# EAGLE design open-lux-U (EAGLE 6.5.0)
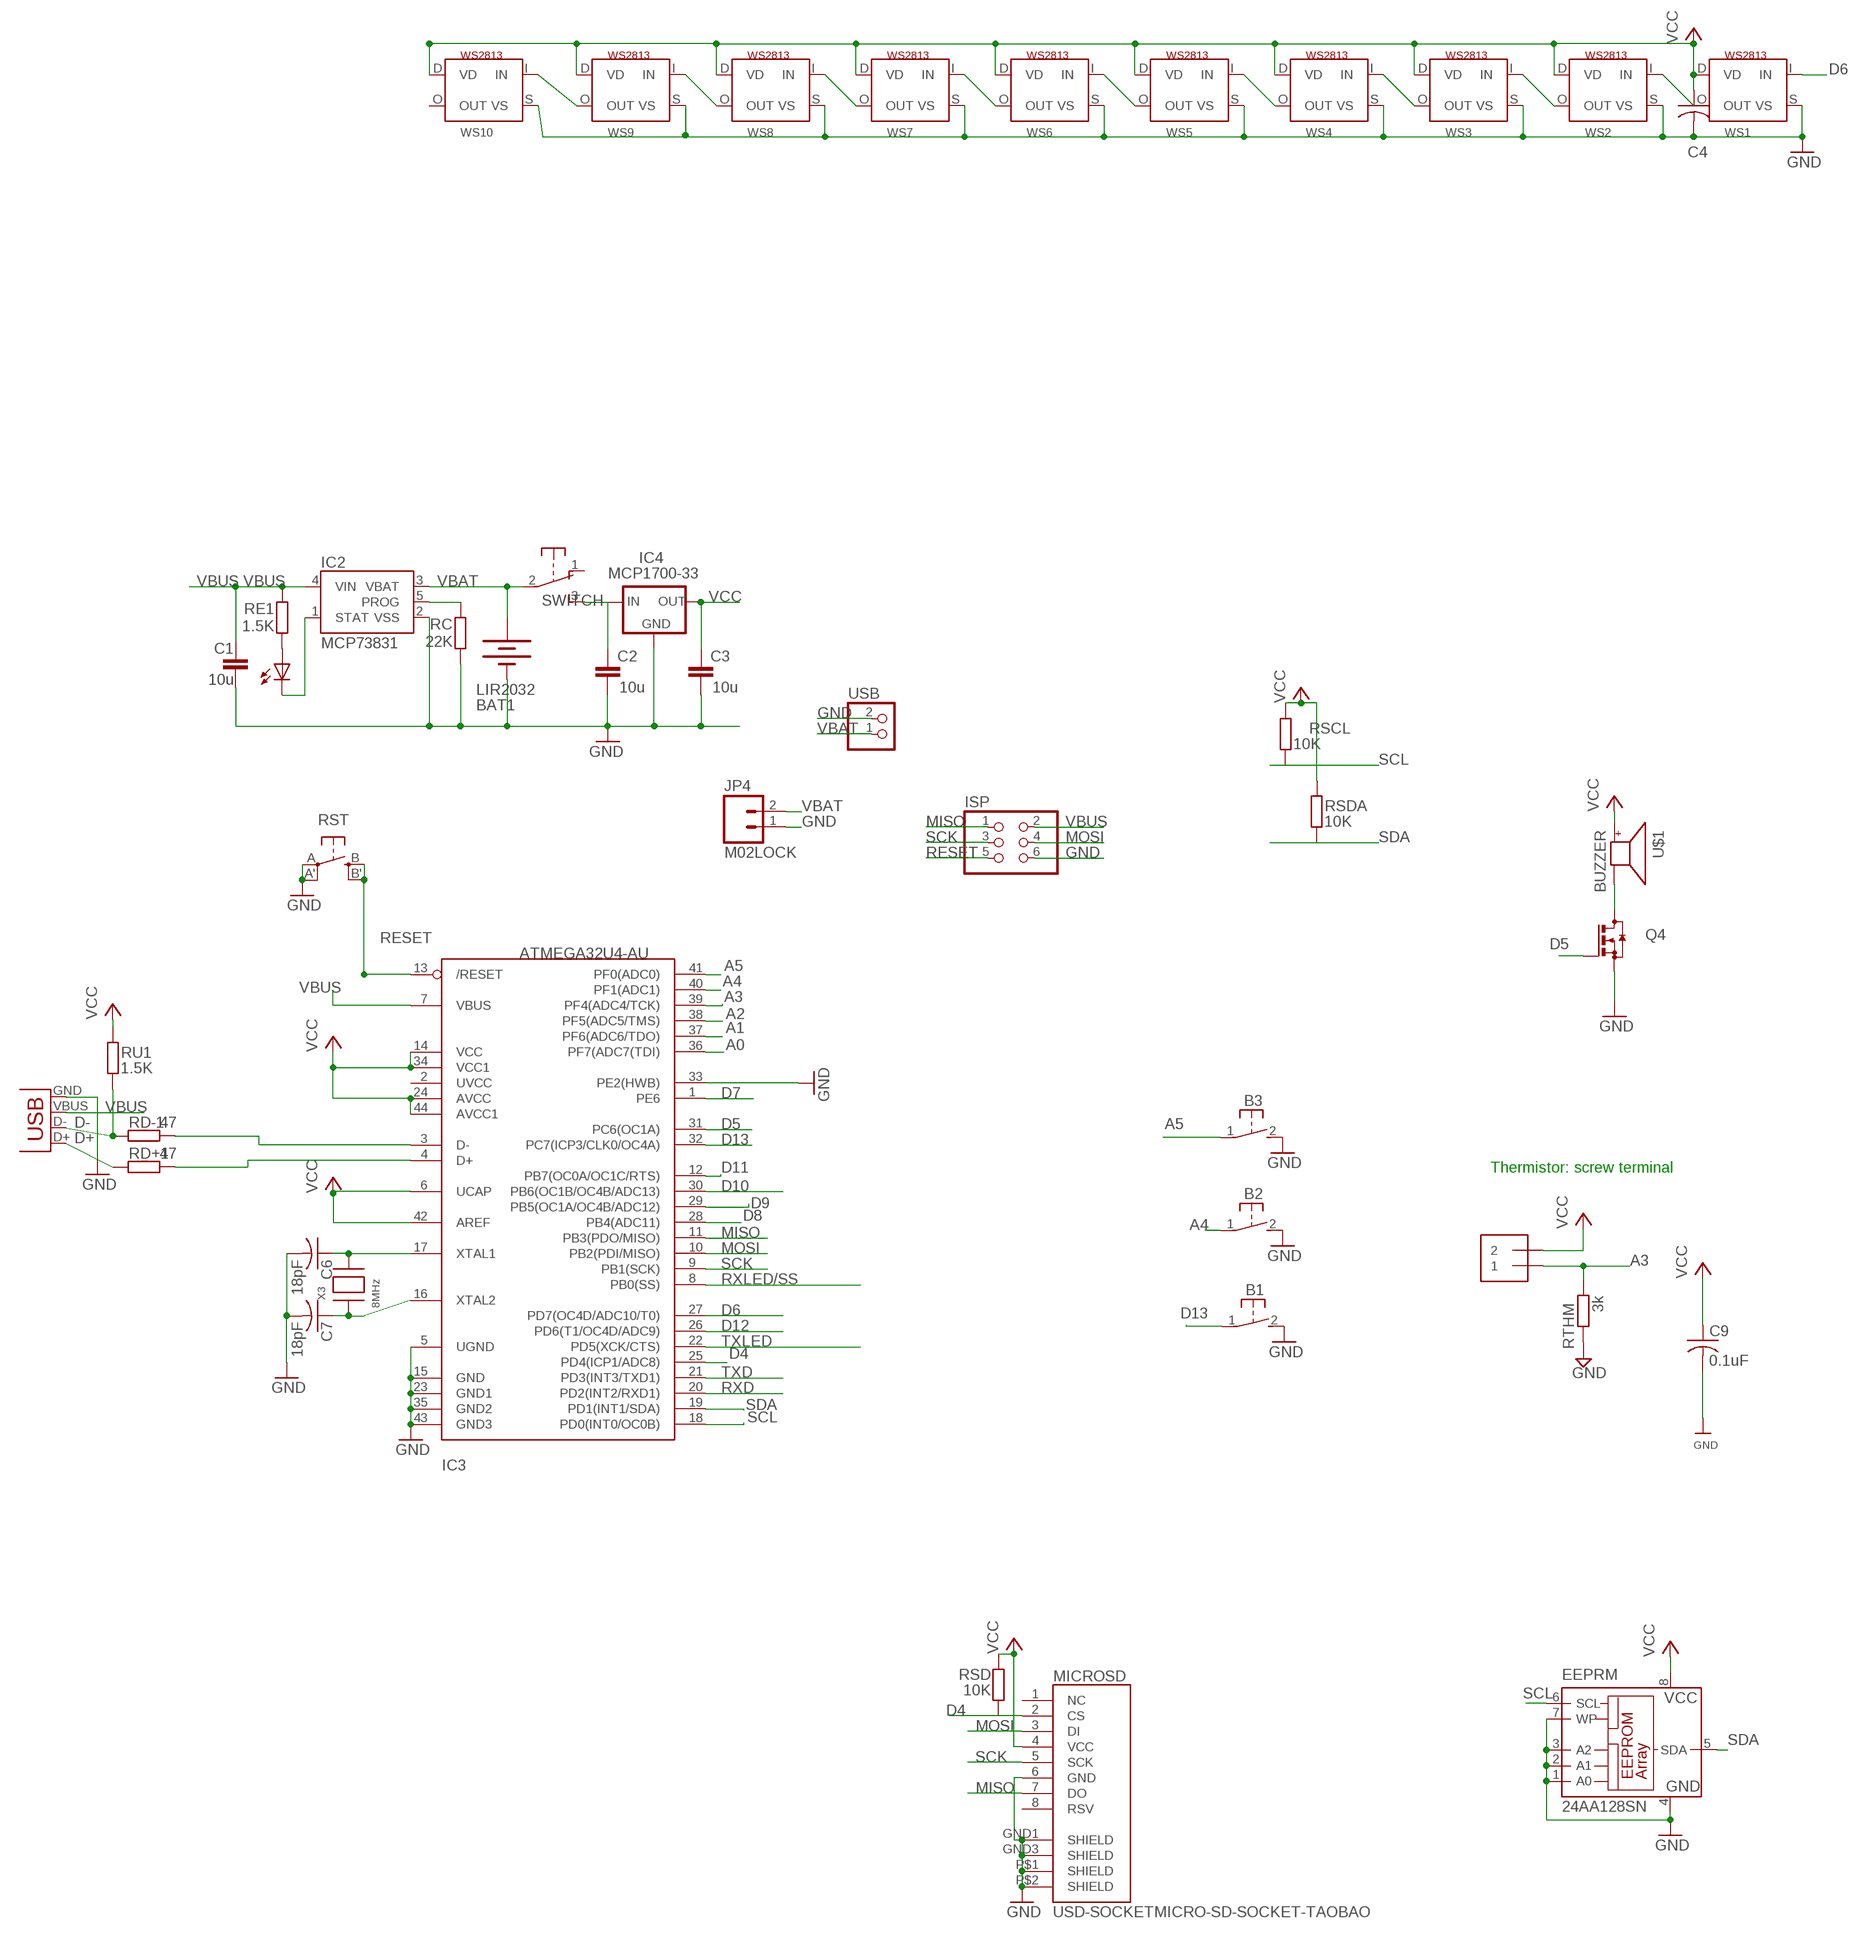
[diagram p0: schematic, sheet 1, part 1 of 2]
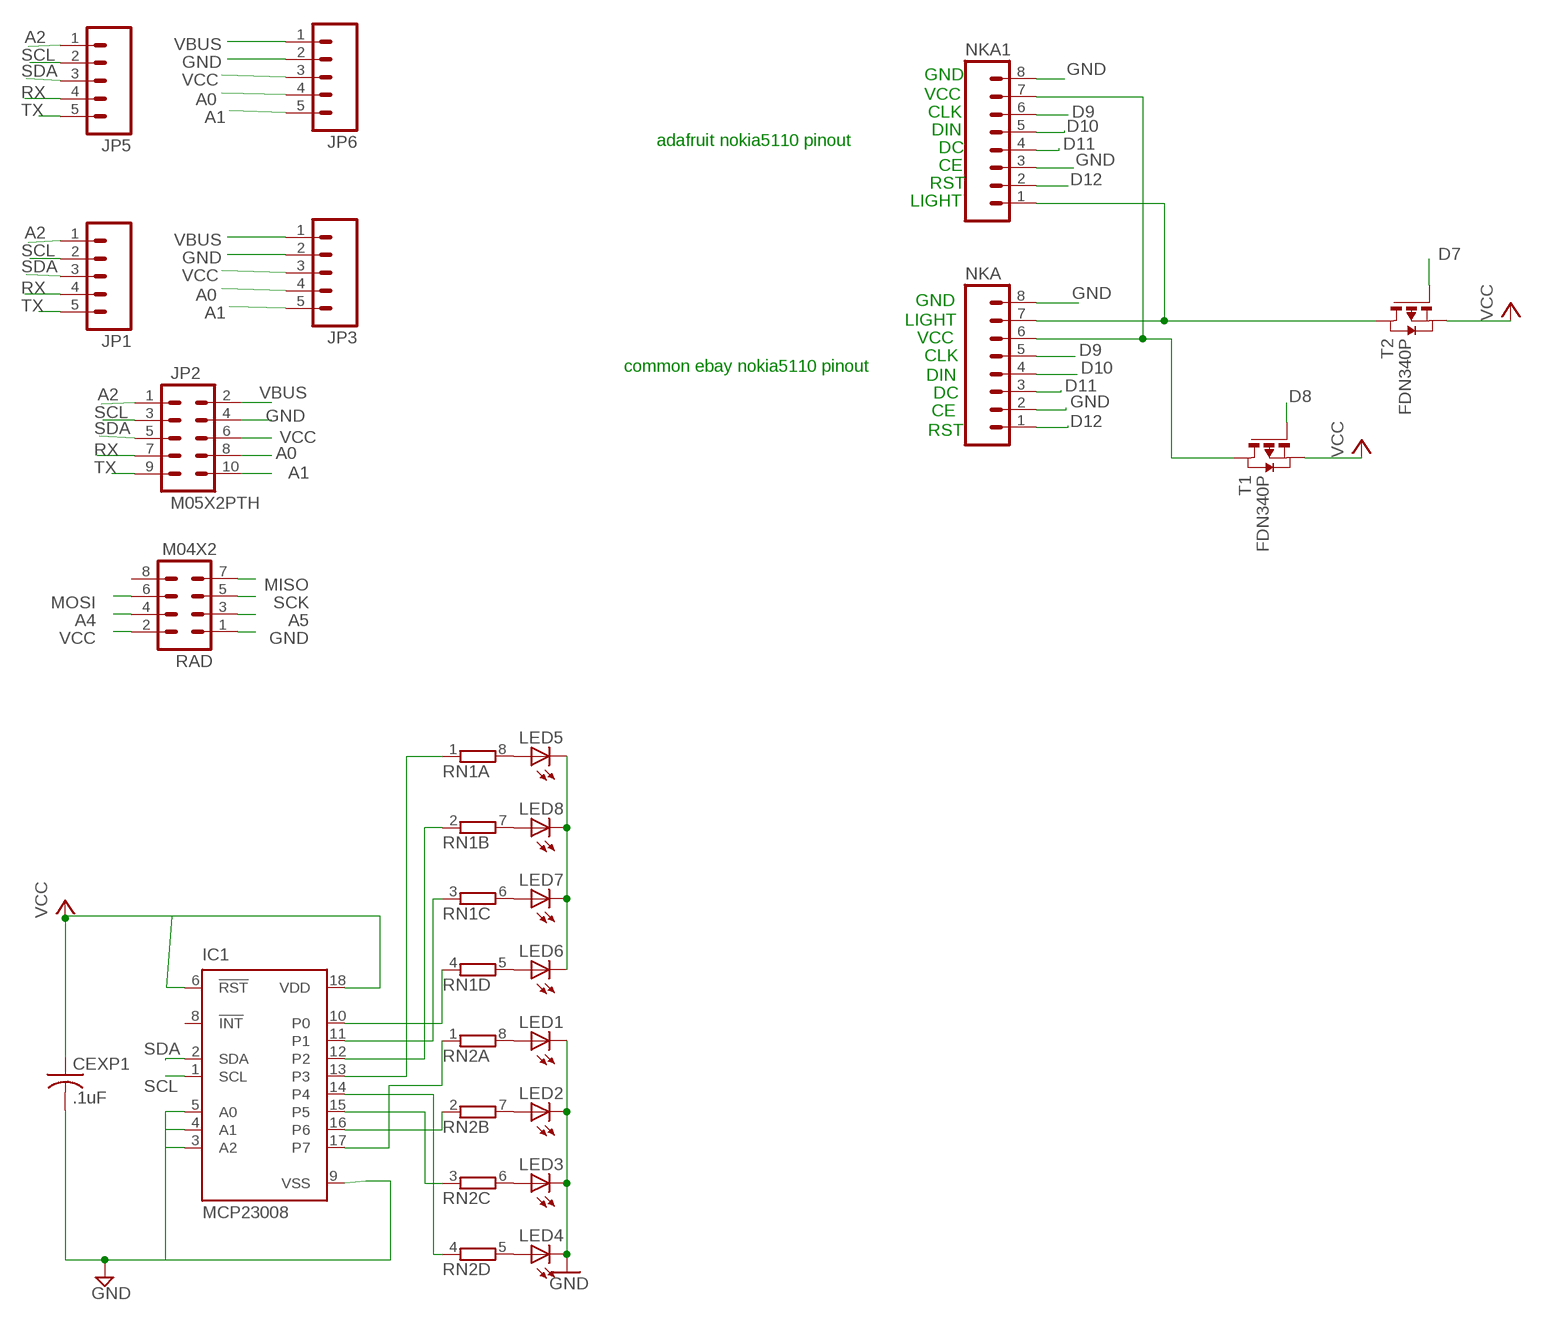
[diagram p1: schematic, sheet 1, part 2 of 2]

## Parts
B1  31-XX  [B3F-31XX]
B2  31-XX  [B3F-31XX]
B3  31-XX  [B3F-31XX]
BAT1  LIR2032  BATTERYBATTCOM_20MM_PTH_SMT  [BATTCOM_20MM_PTH_SMT]
C1  10u  C-EUC0805  [C0805]
C2  10u  C-EUC0805  [C0805]
C3  10u  C-EUC0805  [C0805]
C4  C-USC0805K  [C0805K]
C6  18pF  C-USC0805K  [C0805K]
C7  18pF  C-USC0805K  [C0805K]
C9  0.1uF  C-USC0805  [C0805]
CEXP1  .1uF  C-USC0805K  [C0805K]
EEPRM  24AA128SN  [SO-08]
IC1  MCP23008  MCP23008T  [SO18W]
IC2  MCP73831  [SOT23-5]
IC3  ATMEGA32U4-AU  [TQFP44]
IC4  MCP1700-33  MCP1700SOT233  [SOT23]
ISP  PINHD-2X3  [2X03]
JP1  M05LOCK  [1X05_LOCK]
JP2  M05X2PTH  [AVR_ICSP]
JP3  M05LOCK  [1X05_LOCK]
JP4  M02LOCK  [1X02_LOCK]
JP5  M05LOCK  [1X05_LOCK]
JP6  M05LOCK  [1X05_LOCK]
LED1  LED3MM  [LED3MM]
LED2  LED3MM  [LED3MM]
LED3  LED3MM  [LED3MM]
LED4  LED3MM  [LED3MM]
LED5  LED3MM  [LED3MM]
LED6  LED3MM  [LED3MM]
LED7  LED3MM  [LED3MM]
LED8  LED3MM  [LED3MM]
MICROSD  USD-SOCKETMICRO-SD-SOCKET-TAOBAO  [MICRO-SD-SOCKET-TAOBAO]
NKA  M08LOCK  [1X08_LOCK]
NKA1  M08LOCK  [1X08_LOCK]
PWR  0805  LEDCHIPLED_0805  [CHIPLED_0805]
Q4  BSS123  [SOT23]
RAD  M04X2  [2X4]
RC  22K  R-EU_R0805  [R0805]
RD+1  47  R-EU_R0805  [R0805]
RD-1  47  R-EU_R0805  [R0805]
RE1  1.5K  R-EU_R0805  [R0805]
RN1  4R-NEXB38V  [EXB38V]
RN2  4R-NEXB38V  [EXB38V]
RSCL  10K  R-EU_R0805  [R0805]
RSD  10K  R-EU_R0805  [R0805]
RSDA  10K  R-EU_R0805  [R0805]
RST  EVQQ2  [EVQ-Q2]
RTHM  3k  R-EU_0204/7  [0204/7]
RU1  1.5K  R-EU_R0805  [R0805]
SWITCH  EG1206  [EG1206]
T1  FDN340P  PMOSSOT23  [SOT-23]
T2  FDN340P  PMOSSOT23  [SOT-23]
THM1  1X2-3.5MM  [1X2-3.5MM]
U$1  BUZZER  [SMT-8585-BUZZER]
USB  JST_2PIN-SMT-RA  [JST-PH-2-SMT-RA]
WS1  WS2813  [RGBLED5050_4]
WS2  WS2813  [RGBLED5050_4]
WS3  WS2813  [RGBLED5050_4]
WS4  WS2813  [RGBLED5050_4]
WS5  WS2813  [RGBLED5050_4]
WS6  WS2813  [RGBLED5050_4]
WS7  WS2813  [RGBLED5050_4]
WS8  WS2813  [RGBLED5050_4]
WS9  WS2813  [RGBLED5050_4]
WS10  WS2813  [RGBLED5050_4]
X2  USBSMD  [USB-MINIB]
X3  8MHz  XTALNX5032  [NX5032]

## Nets
A0: IC3.36(PF7(ADC7(TDI)) JP2.8 JP3.4 JP6.4
A1: IC3.37(PF6(ADC6/TDO)) JP2.10 JP3.5 JP6.5
A2: IC3.38(PF5(ADC5/TMS)) JP1.1 JP2.1 JP5.1
A3: IC3.39(PF4(ADC4/TCK)) RTHM.2 THM1.1
A4: B2.1(P) IC3.40(PF1(ADC1)) RAD.4
A5: B3.1(P) IC3.41(PF0(ADC0)) RAD.3
D4: IC3.25(PD4(ICP1/ADC8)) MICROSD.2(CS) RSD.1
D5: IC3.31(PC6(OC1A)) Q4.1(G)
D6: IC3.27(PD7(OC4D/ADC10/T0)) WS1.I(IN)
D7: IC3.1(PE6) T2.3(G)
D8: IC3.28(PB4(ADC11)) T1.3(G)
D9: IC3.29(PB5(OC1A/OC4B/ADC12)) NKA1.6 NKA.5
D10: IC3.30(PB6(OC1B/OC4B/ADC13)) NKA1.5 NKA.4
D11: IC3.12(PB7(OC0A/OC1C/RTS)) NKA1.4 NKA.3
D12: IC3.26(PD6(T1/OC4D/ADC9)) NKA1.2 NKA.1
D13: B1.1(P) IC3.32(PC7(ICP3/CLK0/OC4A))
D+: RD+1.1 X2.D+
D-: RD-1.1 RU1.1 X2.D-
GND: B1.2(S) B2.2(S) B3.2(S) BAT1.P$1(-) C1.2 C2.2 C3.2 C4.2 C6.2 C7.2 C9.2 CEXP1.2 EEPRM.1(A0) EEPRM.2(A1) EEPRM.3(A2) EEPRM.4(GND) EEPRM.7(WP) IC1.3(A2) IC1.4(A1) IC1.5(A0) IC1.9(VSS) IC2.2(VSS) IC3.5(UGND) IC3.15(GND) IC3.23(GND1) IC3.33(PE2(HWB)) IC3.35(GND2) IC3.43(GND3) IC4.1(GND) ISP.6 JP2.4 JP3.2 JP4.1 JP6.2 LED1.K(C) LED2.K(C) LED3.K(C) LED4.K(C) MICROSD.6(GND) MICROSD.GND1(SHIELD) MICROSD.GND3(SHIELD) MICROSD.P$1(SHIELD) MICROSD.P$2(SHIELD) NKA1.3 NKA1.8 NKA.2 NKA.8 Q4.2(S) RAD.1 RC.1 RST.A'(P1) RST.A(P) RTHM.1 USB.2 WS1.S(VS) WS2.S(VS) WS3.S(VS) WS4.S(VS) WS5.S(VS) WS6.S(VS) WS7.S(VS) WS8.S(VS) WS9.S(VS) WS10.S(VS) X2.GND
MISO: IC3.11(PB3(PDO/MISO)) ISP.1 MICROSD.7(DO) RAD.7
MOSI: IC3.10(PB2(PDI/MISO)) ISP.4 MICROSD.3(DI) RAD.6
N$1: C2.1 IC4.3(IN) SWITCH.3(S)
N$2: C7.1 IC3.16(XTAL2) X3.P$1
N$3: C6.1 IC3.17(XTAL1) X3.P$2
N$4: WS9.O(OUT) WS10.I(IN)
N$5: IC2.1(STAT) PWR.C
N$6: IC2.5(PROG) RC.2
N$7: Q4.3(D) U$1.-
N$8: IC1.14(P4) RN2.4
N$9: T2.1(D)
N$10: PWR.A RE1.1
N$11: IC1.15(P5) RN2.3
N$12: NKA1.1 NKA.7
N$13: IC1.16(P6) RN2.2
N$14: WS6.O(OUT) WS7.I(IN)
N$15: IC1.17(P7) RN2.1
N$17: LED1.A RN2.8
N$18: LED2.A RN2.7
N$19: WS4.O(OUT) WS5.I(IN)
N$20: WS5.O(OUT) WS6.I(IN)
N$21: IC3.4(D+) RD+1.2
N$22: IC3.3(D-) RD-1.2
N$23: WS1.O(OUT) WS2.I(IN)
N$24: WS2.O(OUT) WS3.I(IN)
N$25: WS3.O(OUT) WS4.I(IN)
N$26: LED3.A RN2.6
N$27: WS8.O(OUT) WS9.I(IN)
N$28: WS7.O(OUT) WS8.I(IN)
N$29: LED4.A RN2.5
N$30: LED5.K(C) LED6.K(C) LED7.K(C) LED8.K(C)
N$31: NKA1.7 NKA.6 T1.1(D)
N$32: LED5.A RN1.8
N$33: LED6.A RN1.5
N$34: LED7.A RN1.6
N$35: LED8.A RN1.7
N$37: IC1.13(P3) RN1.1
N$38: IC1.12(P2) RN1.2
N$39: IC1.11(P1) RN1.3
N$40: IC1.10(P0) RN1.4
RESET: IC3.13(/RESET) ISP.5 RST.B'(S1) RST.B(S)
RX: JP1.4 JP2.7 JP5.4
RXD: IC3.20(PD2(INT2/RXD1))
RXLED/SS: IC3.8(PB0(SS))
SCK: IC3.9(PB1(SCK)) ISP.3 MICROSD.5(SCK) RAD.5
SCL: EEPRM.6(SCL) IC1.1(SCL) IC3.18(PD0(INT0/OC0B)) JP1.2 JP2.3 JP5.2 RSCL.1
SDA: EEPRM.5(SDA) IC1.2(SDA) IC3.19(PD1(INT1/SDA)) JP1.3 JP2.5 JP5.3 RSDA.1
TX: JP1.5 JP2.9 JP5.5
TXD: IC3.21(PD3(INT3/TXD1))
TXLED: IC3.22(PD5(XCK/CTS))
VBAT: BAT1.P$2(+) IC2.3(VBAT) JP4.2 SWITCH.2(P) USB.1
VBUS: C1.1 IC2.4(VIN) IC3.7(VBUS) ISP.2 JP2.2 JP3.1 JP6.1 RE1.2 X2.VBUS
VCC: C3.1 C4.1 C9.1 CEXP1.1 EEPRM.8(VCC) IC1.6(!RST) IC1.18(VDD) IC3.6(UCAP) IC3.14(VCC) IC3.24(AVCC) IC3.34(VCC1) IC3.42(AREF) IC3.44(AVCC1) IC4.2(OUT) JP2.6 JP3.3 JP6.3 MICROSD.4(VCC) RAD.2 RSCL.2 RSD.2 RSDA.2 RU1.2 T1.2(S) T2.2(S) THM1.2 U$1.+ WS1.D(VD) WS2.D(VD) WS3.D(VD) WS4.D(VD) WS5.D(VD) WS6.D(VD) WS7.D(VD) WS8.D(VD) WS9.D(VD) WS10.D(VD)
Unconnected: IC1.8(!INT) IC3.2(UVCC) MICROSD.1(NC) MICROSD.8(RSV) RAD.8 SWITCH.1(O) WS10.O(OUT)

## Notes on the sheet
- GND
- VCC
- CLK
- adafruit nokia5110 pinout | DIN
- DC
- CE
- RST
- LIGHT
- GND
- LIGHT
- VCC
- common ebay nokia5110 pinout | CLK
- DIN
- DC
- CE
- RST
- Thermistor: screw terminal

## Library data of the parts
B1-B3 = adafruit:31-XX: OMRON SWITCH Now with beefier pads!
BAT1 = SparkFunNew:BATTERY: Battery Holders Various common sizes : AA, AAA, 20mm coin cell and 12mm coin cell.
C1-C3 = resistor:C-EU: CAPACITOR, European symbol
C4 = adafruit2013:C-US: CAPACITOR, American symbol
C6 C7 C9 CEXP1 = adafruit:C-US: CAPACITOR, American symbol
EEPRM = microchip:24*: Serial EEPROM I2C; MF: MICROCHIP; MPN: 24AA128-I/SN; OC_FARNELL: unknown; OC_NEWARK: 92C6842
IC1 = JeeLabs:MCP23008: I2C-Bus Remote 8-bit I/O expander http://www.semiconductors.philips.com/acrobat_download/datasheets/PCF8574_4.pdf
IC2 = SparkFunNew:MCP73831: Microchip's MCP73831 Miniature single cell, fully integrated Li-Ion, Li-polymer charge management controller http://ww1.microchip.com/downloads/en/DeviceDoc/21984a.pdf
IC3 = adaprog:ATMEGA32U4
IC4 = adafruit:MCP1700: VOLTAGE REGULATOR
ISP = pinhead:PINHD-2X3: PIN HEADER
JP1 JP3 JP5 JP6 = SparkFun-Connectors:M05: Header 5 Standard 5-pin 0.1" header. Use with straight break away headers (SKU : PRT-00116), right angle break away headers (PRT-00553), swiss pins (PRT-00743), machine pins (PRT-00117), and female headers (PRT-00115). Molex polarized connector foot print use with SKU : PRT-08230 with associated crimp pins and housings.
JP2 = SparkFun-Connectors:M05X2: Header 5x2 Standard 10-pin dual row 0.1" header. Commonly used with AVR-ISP. Use with Spark Fun Electronics SKU: PRT-00778
JP4 = SparkFun-Connectors:M02: Standard 2-pin 0.1" header. Use with - straight break away headers ( PRT-00116) - right angle break away headers (PRT-00553) - swiss pins (PRT-00743) - machine pins (PRT-00117) - female headers (PRT-00115) Molex polarized connector foot print use with: PRT-08233 with associated crimp pins and housings. 2.54_SCREWTERM for use with PRT-10571. 3.5mm Screw Terminal footprints for PRT-08084 5mm Screw Terminal footprints for use with PRT-08433
LED1-LED8 = adafruit:LED: LED
MICROSD = SparkFunNew:USD-SOCKET: microSD Socket Push-push type uSD socket. Schematic element and footprint production proven. Spark Fun Electronics SKU : PRT-00127. tDoc lines correctly indicate media card edge positions when inserting (unlocked, locked, depressed).
NKA NKA1 = SparkFun-Connectors:M08: Header 8 Standard 8-pin 0.1" header. Use with straight break away headers (SKU : PRT-00116), right angle break away headers (PRT-00553), swiss pins (PRT-00743), machine pins (PRT-00117), and female headers (PRT-00115).
PWR = led:LED: LED
Q4 = transistor-small-signal:BSS123: N-CHANNEL MOS FET
RAD = SparkFun-Connectors:M04X2: .1" header, two rows of four.
RC RD+1 RD-1 RE1 RSCL RSD RSDA RTHM RU1 = rcl:R-EU_: RESISTOR, European symbol
RN1 RN2 = resistor-dil:4R-N: Array Chip Resistor Source: RS Component / Phycomp; OC_FARNELL: unknown; OC_NEWARK: unknown
RST = adafruit:EVQQ2: SMT 6mm switch, EVQQ2 series http://www.ladyada.net/library/eagle
SWITCH = adafruit:EG1206
T1 T2 = zetex:PMOSSOT23: MOS FET
THM1 = adafruit:1X2: 3.5mm Terminal block http://www.ladyada.net/library/pcb/eaglelibrary.html
U$1 = adafruit:BUZZER
USB = adafruit:JST_2PIN: JST 2-Pin Connectors of various flavors SMT-RA (S2B-PH-SM4) 4UConnector #17311 SMT (B2B-PH-SM4) THM-RA (S2B-PH) THM (B2B-PH)
WS1-WS10 = adafruit:WS2813
X2 = SparkFun:USB: USB Connectors USB-B-PTH is fully proven SKU : PRT-00139 USB-miniB is fully proven SKU : PRT-00587 USB-A-PCB is untested. USB-A-H is throughly reviewed, but untested. Spark Fun Electronics SKU : PRT-00437 USB-B-SMT is throughly reviewed, but untested. Needs silkscreen touching up. USB-A-S has not been used/tested USB-MB-H has not been used/tested
X3 = adaprog:XTAL

## Net classes
0 default: width 0.254 mm, clearance 0.254 mm
1 power: width 0.813 mm, clearance 0.203 mm

## Board
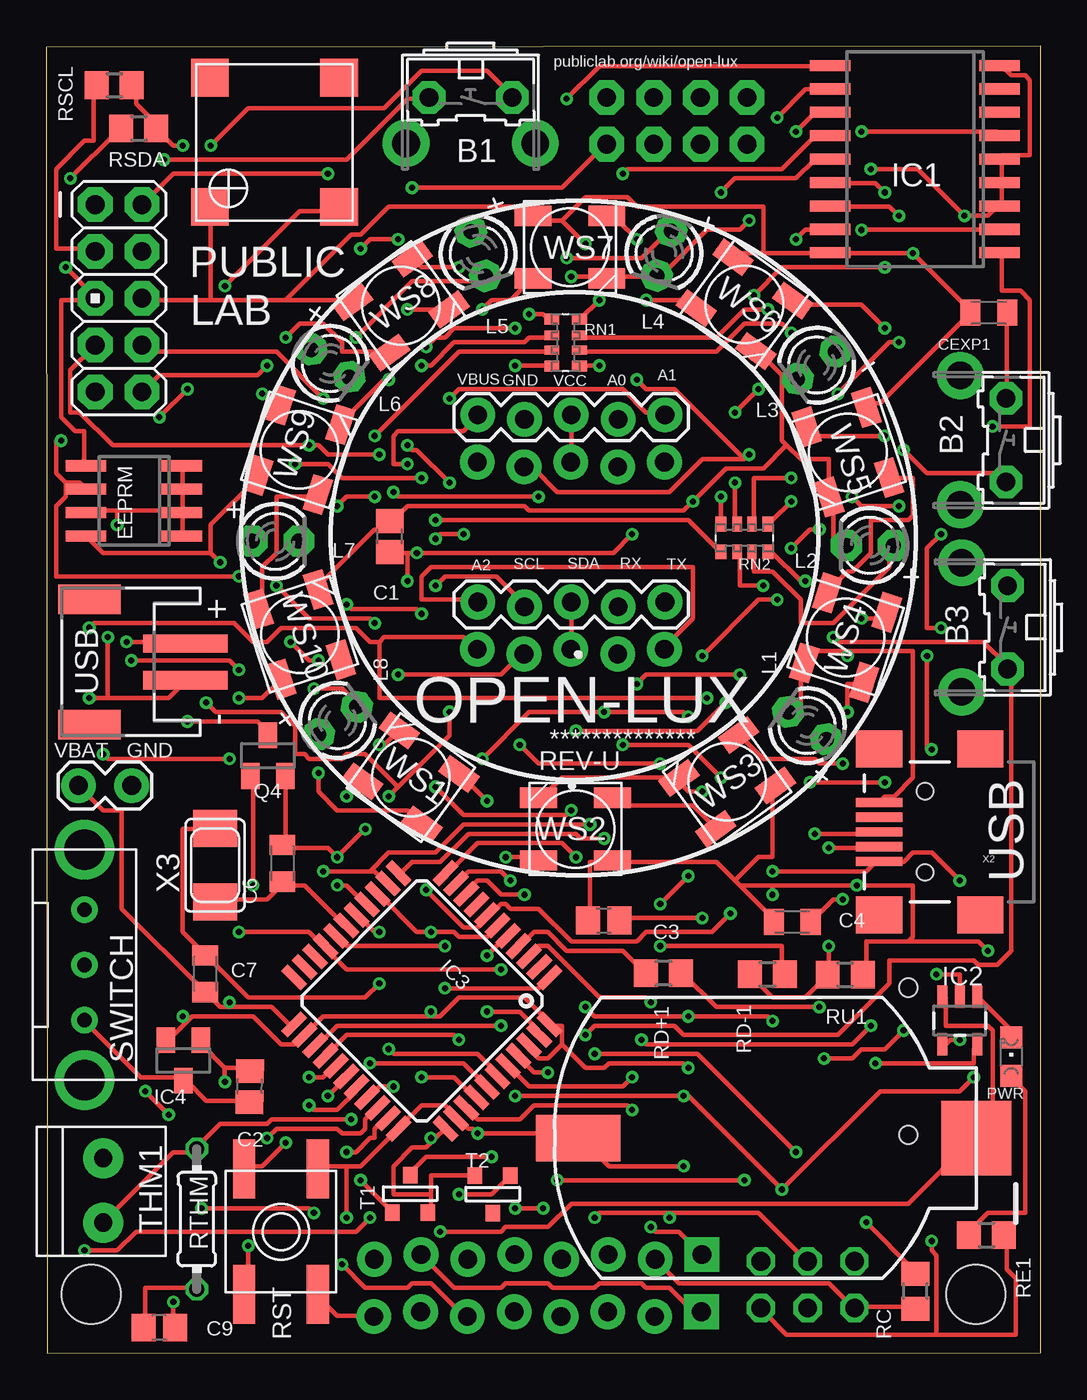
[diagram p2: board, top side]
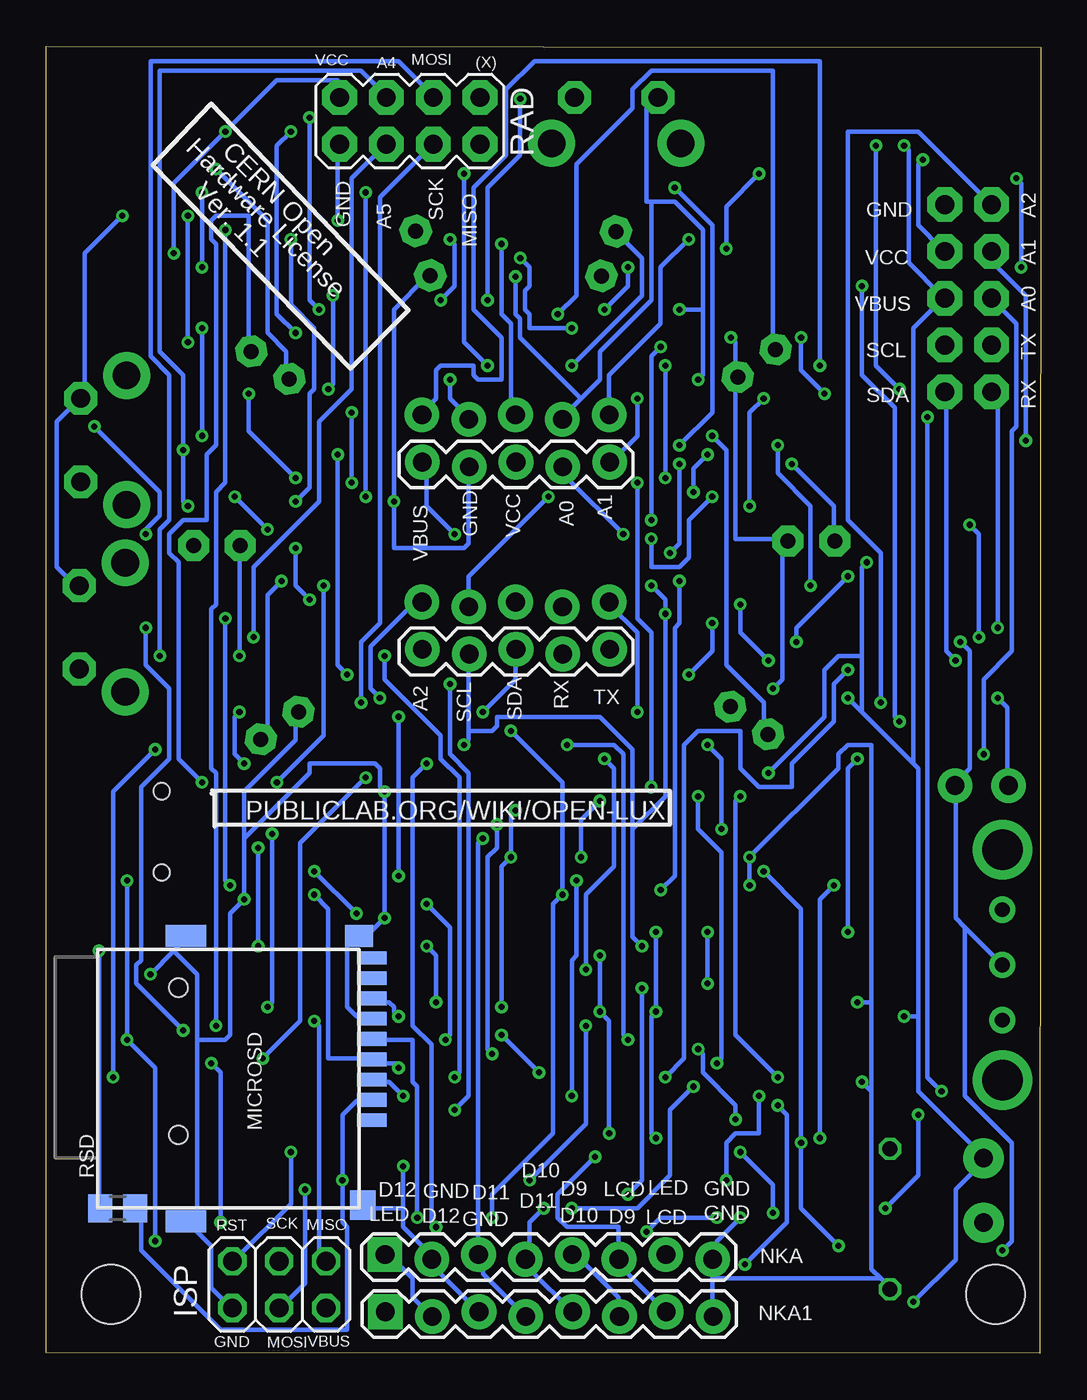
[diagram p3: board, bottom side, seen from below]

Size 53.98 x 70.93 mm. Coordinates in mm from the lower left corner, seen from the top.
Outline: 0.05,0 53.97,0.03 53.97,70.93 0,70.88 0.05,0
Copper layers (1*16): Top 0.0356mm / dielectric 1.5011mm / Bottom 0.0356mm
Design rules "LaenPCBOrder": minimum track width 6mil, minimum drill 13mil, track to track 6mil, track to pad 6mil, pad to pad 6mil, via to via 6mil, smd to smd 6mil, copper to edge 15mil, drill to drill 6mil, minimum pad ring 7mil, minimum via ring 7mil, stop-mask expansion 3mil, vias tented up to drill 0mil, thermal gap 10mil
Holes 3.2 mm at 50.45,3.2 2.45,3.2

### Footprints (pad centres in the part's own frame; a part is rotated, then mirrored left to right if it is on the bottom)
B3F-31XX = drill 1.016 pad 1.778 octagon: 1 -2.261,-1.245; 2 2.261,-1.245 | drill 1.499 pad 2.54: 3 -3.505,1.245; 4 3.505,1.245
BATTCOM_20MM_PTH_SMT = smd 4.572 x 2.54: P$1 0,0 | smd 3.81 x 4.064: P$2 21.59,0
C0805 = smd 1.3 x 1.5: 1 -0.85,0; 2 0.85,0
C0805K = smd 1.1 x 1.4: 1 -1,0; 2 1,0
SO-08 = smd 0.6 x 2.2: 1 -1.905,-2.6; 2 -0.635,-2.6; 3 0.635,-2.6; 4 1.905,-2.6; 5 1.905,2.6; 6 0.635,2.6; 7 -0.635,2.6; 8 -1.905,2.6
SO18W = smd 0.6 x 2.2: 1 -5.08,-4.6; 2 -3.81,-4.6; 3 -2.54,-4.6; 4 -1.27,-4.6; 5 0,-4.6; 6 1.27,-4.6; 7 2.54,-4.6; 8 3.81,-4.6; 9 5.08,-4.6; 10 5.08,4.6; 11 3.81,4.6; 12 2.54,4.6; 13 1.27,4.6; 14 0,4.6; 15 -1.27,4.6; 16 -2.54,4.6; 17 -3.81,4.6; 18 -5.08,4.6
SOT23-5 = smd 0.55 x 1.2: 1 -0.95,-1.3; 2 0,-1.3; 3 0.95,-1.3; 4 0.95,1.3; 5 -0.95,1.3
TQFP44 = smd 1.5 x 0.5: 1 -5.8,4; 2 -5.8,3.2; 3 -5.8,2.4; 4 -5.8,1.6; 5 -5.8,0.8; 6 -5.8,0; 7 -5.8,-0.8; 8 -5.8,-1.6; 9 -5.8,-2.4; 10 -5.8,-3.2; 11 -5.8,-4; 23 5.8,-4; 24 5.8,-3.2; 25 5.8,-2.4; 26 5.8,-1.6; 27 5.8,-0.8; 28 5.8,0; 29 5.8,0.8; 30 5.8,1.6; 31 5.8,2.4; 32 5.8,3.2; 33 5.8,4 | smd 0.5 x 1.5: 12 -4,-5.8; 13 -3.2,-5.8; 14 -2.4,-5.8; 15 -1.6,-5.8; 16 -0.8,-5.8; 17 0,-5.8; 18 0.8,-5.8; 19 1.6,-5.8; 20 2.4,-5.8; 21 3.2,-5.8; 22 4,-5.8; 34 4,5.8; 35 3.2,5.8; 36 2.4,5.8; 37 1.6,5.8; 38 0.8,5.8; 39 0,5.8; 40 -0.8,5.8; 41 -1.6,5.8; 42 -2.4,5.8; 43 -3.2,5.8; 44 -4,5.8
SOT23 = smd 1 x 1.4: 1 -0.95,-1.1; 2 0.95,-1.1; 3 0,1.1
2X03 = drill 1.016 octagon: 1 -2.54,-1.27; 2 -2.54,1.27; 3 0,-1.27; 4 0,1.27; 5 2.54,-1.27; 6 2.54,1.27
1X05_LOCK = drill 1.016 pad 1.88: 1 0,0.127; 2 2.54,-0.127; 3 5.08,0.127; 4 7.62,-0.127; 5 10.16,0.127
AVR_ICSP = drill 1.016 pad 1.88 octagon: 1 -1.27,5.08; 2 1.27,5.08; 3 -1.27,2.54; 4 1.27,2.54; 5 -1.27,0; 6 1.27,0; 7 -1.27,-2.54; 8 1.27,-2.54; 9 -1.27,-5.08; 10 1.27,-5.08
1X02_LOCK = drill 1.016 pad 1.88: 1 -0.178,0; 2 2.718,0
LED3MM = drill 0.813 pad 1.676 octagon: A -1.27,0; K 1.27,0
MICRO-SD-SOCKET-TAOBAO = smd 0.75 x 1.6: 1 2.25,10.5; 2 1.15,10.5; 3 0.05,10.5; 4 -1.05,10.5; 5 -2.15,10.5; 6 -3.25,10.5; 7 -4.35,10.5; 8 -5.45,10.5 | smd 0.7 x 1.6: CD -6.55,10.5 | smd 1.2 x 1.5: GND1 -7.75,9.8 | smd 1.6 x 1.4: GND3 6.85,10 | smd 1.2 x 2.2: P$1 7.75,0.4; P$2 -7.75,0.4 | hole 1: 3.05,0; -4.93,0
1X08_LOCK = drill 1.016 pad 1.88 square: 1 0,0.127 | drill 1.016 pad 1.88: 2 2.54,-0.127; 3 5.08,0.127; 4 7.62,-0.127; 5 10.16,0.127; 6 12.7,-0.127; 7 15.24,0.127; 8 17.78,-0.127
CHIPLED_0805 = smd 1.2 x 1.2: A 0,-1.05; C 0,1.05
2X4 = drill 1.016 pad 1.88 octagon: 1 -3.81,-1.27; 2 -3.81,1.27; 3 -1.27,-1.27; 4 -1.27,1.27; 5 1.27,-1.27; 6 1.27,1.27; 7 3.81,-1.27; 8 3.81,1.27
R0805 = smd 1.3 x 1.5: 1 -0.95,0; 2 0.95,0
EXB38V = smd 0.6 x 0.8: 1 -1.275,-0.75; 4 1.275,-0.75; 5 1.275,0.75; 8 -1.275,0.75 | smd 0.5 x 0.8: 2 -0.4,-0.75; 3 0.4,-0.75; 6 0.4,0.75; 7 -0.4,0.75
EVQ-Q2 = smd 3.2 x 1.2: A -3.4,-2; A' 3.4,-2; B -3.4,2; B' 3.4,2
0204/7 = drill 0.813 octagon: 1 -3.81,0; 2 3.81,0
EG1206 = drill 0.8 pad 1.422: 1 -3,0; 2 0,0; 3 3,0 | drill 2.2: MT1 -6.25,0; MT2 6.25,0
SOT-23 = smd 0.787 x 0.889: 1 0.025,-1.016; 2 -0.94,1.016; 3 0.991,1.016
1X2-3.5MM = drill 1 pad 2.184: 1 1.8,0; 2 -1.7,0
SMT-8585-BUZZER = smd 2.05 x 2.05: + -3.5,-3.5; - 3.5,-3.5; NC1 -3.5,3.5; NC2 3.5,3.5
JST-PH-2-SMT-RA = smd 1 x 4.6: 1 1,-3.7; 2 -1,-3.7 | smd 1.6 x 3.4: NC1 -3.4,1.5; NC2 3.4,1.5
RGBLED5050_4 = smd 2 x 1.1: D -2,1.7; I 2,1.7; O -2,-1.7; S 2,-1.7
USB-MINIB = smd 2.5 x 0.5: D+ 2.5,0; D- 2.5,0.8; GND 2.5,-1.6; ID 2.5,-0.8; VBUS 2.5,1.6 | smd 2.5 x 2: GND@1 -3,-4.5; GND@2 -3,4.5; GND@3 2.5,4.5; GND@4 2.5,-4.5 | hole 0.9: 0,2.2; 0,-2.2
NX5032 = smd 2 x 2.4: P$1 2,0; P$2 -2,0

### Placement (x,y rotation side)
B1  23.04,66.9 180 top
B2  50.85,49.56 90 top
B3  50.93,39.4 90 top
BAT1  28.88,11.68 0 top
C1  18.64,44.32 90 top
C2  11.05,14.48 89 top
C3  30.25,23.5 0 top
C4  40.49,23.42 0 top
C6  12.83,26.59 90 top
C7  8.64,20.6 270 top
C9  6.15,1.4 180 top
CEXP1  51.16,56.46 0 top
EEPRM  4.78,46.25 90 top
IC1  47.14,64.8 90 top
IC2  49.58,18.06 180 top
IC3  20.4,19.13 225 top
IC4  7.44,15.9 180 top
ISP  41.33,3.73 180 bottom
JP1  23.42,40.64 0 top
JP2  3.94,57.25 0 top
JP3  23.42,50.8 0 top
JP4  1.93,30.81 0 top
JP5  33.55,38.07 0 bottom
JP6  33.55,48.23 0 bottom
LED1  41.3,34.06 144 top
LED2  44.7,43.84 180 top
LED3  41.81,53.62 216 top
LED4  33.53,59.69 252 top
LED5  23.44,59.66 288 top
LED6  15.42,53.72 324 top
LED7  12.45,44.07 0 top
LED8  15.82,34.34 36 top
MICROSD  46.79,14.91 270 bottom
NKA  35.59,5.23 0 bottom
NKA1  35.56,2.13 0 bottom
PWR  52.37,16.1 0 top
Q4  12.04,32.44 0 top
RAD  34.24,66.88 0 bottom
RC  47.17,3.38 90 top
RD+1  33.5,20.62 180 top
RD-1  39.14,20.57 0 top
RE1  51.03,6.43 0 top
RN1  28.19,54.84 90 top
RN2  37.9,44.25 180 top
RSCL  3.71,68.81 0 top
RSD  50.09,7.87 180 bottom
RSDA  5.03,66.47 0 top
RST  12.75,6.6 90 top
RTHM  8.18,7.29 90 top
RU1  43.36,20.55 0 top
SWITCH  2.08,21.08 270 top
T1  19.79,8.66 180 top
T2  24.21,8.64 0 top
THM1  3.1,8.89 270 top
U$1  12.4,65.71 0 top
USB  3.86,37.52 90 top
WS1  19.79,31.24 144 top
WS2  28.73,28.45 180 top
WS3  36.96,31.01 216 top
WS4  43.38,38.84 252 top
WS5  43.51,48.9 288 top
WS6  37.9,56.92 324 top
WS7  28.42,60.02 0 top
WS8  19.25,56.85 36 top
WS9  13.74,49.02 72 top
WS10  13.77,39.01 108 top
X2  47.7,28.3 180 top
X3  9.17,26.49 90 top

### Tracks (layer width: path | path; a pad name or v marks a point on that pad's centre or on a via)
A0  (via drill 0.33)
  Top 0.254: v31.8,13.21 31.55,13.46 26.47,13.46 25.7,12.7 23.42,12.7 22.91,13.21 IC3.36 | v32.05,36.32 32.56,36.83 v37.64,36.83 | 37.9,48.51 v38.15,48.77 | 37.9,48.51 35.61,48.51 33.83,46.74 27.74,46.74 26.47,48.01 25.96,48.01 JP6.4 | v32.05,52.83 32.56,52.32 34.09,52.32 37.9,48.51 | v15.04,51.82 12.5,54.36 5.64,54.36 5.38,54.61 JP2.8 | v15.8,45.97 16.31,46.48 v17.83,46.48 | v21.13,44.2 21.39,44.45 v22.66,44.45
  Bottom 0.254: v31.8,13.21 31.04,13.97 31.04,31.5 32.05,32.51 v32.05,36.32 | v37.64,36.83 38.15,37.34 v38.15,48.77 | v32.05,52.83 32.05,51.82 31.04,50.8 JP3.4 | v15.04,51.82 15.8,51.05 v15.8,45.97 | v17.83,46.48 19.1,45.21 19.1,43.18 19.61,42.67 21.13,42.67 v21.13,44.2 | v22.66,44.45 25.7,47.5 25.7,48.01 JP6.4
A1  (via drill 0.33)
  Top 0.254: v21.89,51.82 22.4,52.32 31.29,52.32 32.56,51.05 33.58,51.05 JP3.5 | v20.37,14.99 22.15,14.99 23.16,13.97 IC3.37 | v10.46,37.08 9.96,37.59 v4.62,37.59 | v11.99,53.59 11.48,53.09 6.15,53.09 5.38,52.32 JP2.10
  Bottom 0.254: v21.89,51.82 21.89,49.78 23.16,48.51 JP6.5 | v20.37,14.99 19.35,16 19.35,33.02 18.59,33.78 16.31,33.78 16.31,31.75 15.29,30.73 13.51,30.73 13.51,32 11.23,34.29 11.23,36.32 v10.46,37.08 | v4.62,37.59 5.13,38.1 5.13,52.07 JP2.10 | v11.99,53.59 11.99,70.1 27.48,70.1 29.01,68.58 29.01,65.02 30.78,63.25 30.78,56.64 29.26,55.12 29.26,52.83 30.53,52.83 30.78,53.09 30.78,53.59 32.56,53.59 32.82,53.34 32.82,51.82 33.58,51.05 JP3.5
A2  (via drill 0.33)
  Top 0.254: v17.58,15.75 22.66,15.75 23.93,14.48 IC3.38 | 19.1,30.73 21.89,33.53 v21.89,34.8 | 19.1,30.73 v18.59,30.23 | JP5.1 33.58,38.35 35.1,39.88 35.1,42.67 20.88,42.67 20.37,42.16 20.37,40.89 23.42,40.89 JP1.1 | v8.69,35.31 9.19,34.8 12.75,34.8 13.51,34.04 13.51,32.51 14.02,32.51 14.27,32.26 16.05,32.26 16.31,32.51 17.32,32.51 19.1,30.73
  Bottom 0.254: v17.58,15.75 17.32,16 17.32,27.18 18.59,28.45 v18.59,30.23 | v21.89,34.8 21.89,39.12 23.42,40.64 JP1.1 | v8.69,35.31 8.69,43.43 10.46,45.21 10.46,66.29 6.65,66.29 2.84,62.48 JP2.1
A3  (via drill 0.33)
  Top 0.254: v18.59,16.51 18.85,16.26 23.42,16.26 24.43,15.24 IC3.39 | v16.56,12.7 12.24,12.7 11.99,12.45 9.45,12.45 8.18,11.18 RTHM.2 8.18,10.92 6.91,10.92 3.1,7.11 THM1.1
  Bottom 0.254: v18.59,16.51 18.34,16.26 18.34,15.24 16.56,13.46 v16.56,12.7
A4  (via drill 0.33)
  Top 0.254: v31.8,14.99 31.29,14.48 26.21,14.48 25.2,15.49 IC3.40 | v35.61,37.85 38.66,40.89 v39.67,40.89 | v40.44,43.69 41.45,44.7 v41.96,44.7 | v43.74,46.48 44.25,45.97 v46.28,45.97 | v46.53,49.02 47.8,47.75 51.61,47.75 51.87,47.5 B2.1
  Bottom 0.254: v31.8,14.99 31.55,15.24 31.55,31.24 32.56,32.26 32.56,33.53 35.61,36.58 v35.61,37.85 | v39.67,40.89 40.44,41.66 v40.44,43.69 | v43.74,46.48 v41.96,44.7 | v46.28,45.97 46.53,46.23 v46.53,49.02 46.53,53.09 47.8,54.36 47.8,69.6 36.88,69.6 35.61,68.33 RAD.4
A5  (via drill 0.33)
  Top 0.254: v27.23,15.24 26.47,15.24 25.7,16 IC3.41 | v29.26,17.27 29.77,17.78 34.09,17.78 34.59,17.27 42.98,17.27 45.77,20.07 45.77,21.34 50.34,21.34 50.6,21.08 51.61,21.08 52.37,21.84 52.37,37.08 B3.1 52.12,37.34 50.85,38.61 42.98,38.61 v42.72,38.86
  Bottom 0.254: v29.26,17.27 v27.23,15.24 | v42.72,38.86 42.72,42.67 39.17,46.23 39.17,50.55 37.39,52.32 37.39,63.75 35.61,65.53 RAD.3
D4  (via drill 0.33)
  Top 0.254: v24.69,17.78 15.8,17.78 14.78,16.76 IC3.25 | v37.9,9.4 v27.74,9.4
  Bottom 0.254: RSD.1 49.07,7.87 48.82,7.62 48.82,5.59 44.5,1.27 37.64,1.27 37.64,6.86 37.9,7.11 v37.9,9.4 37.9,12.95 37.13,13.72 36.37,13.72 MICROSD.2 | v24.69,17.78 24.69,12.45 v27.74,9.4
D5  (via drill 0.33)
  Top 0.254: v11.23,25.4 11.23,31.24 Q4.1 | v11.99,11.68 12.5,12.19 15.8,12.19 16.05,11.94 17.07,11.94 17.32,12.19 17.32,12.7 17.83,13.21 IC3.31
  Bottom 0.254: v11.23,25.4 11.99,24.64 v11.99,11.68
D6  (via drill 0.33)
  Top 0.254: v14.27,14.99 15.04,14.99 15.54,15.49 IC3.27 | v16.31,30.23 17.07,30.99 WS1.I
  Bottom 0.254: v14.27,14.99 16.56,17.27 16.56,29.97 v16.31,30.23
D7  (via drill 0.33)
  Top 0.254: T2.3 24.18,8.64 v22.4,8.64 | v21.64,19.81 26.72,19.81 27.23,20.32 IC3.1
  Bottom 0.254: v22.4,8.64 21.64,9.4 v21.64,19.81
D8  (via drill 0.33)
  Top 0.254: v17.07,9.4 18.59,7.87 T1.3 | v15.29,13.97 16.31,14.99 IC3.28
  Bottom 0.254: v17.07,9.4 17.07,11.43 16.56,11.94 15.29,11.94 v15.29,13.97
D9  (via drill 0.33)
  Top 0.254: v14.27,13.46 14.53,13.21 15.8,13.21 16.81,14.22 IC3.29 | v16.05,4.83 17.32,3.56 19.61,3.56 19.86,3.81 20.88,3.81 22.66,2.03 NKA1.6
  Bottom 0.254: v14.27,13.46 13.77,12.95 13.77,7.11 v16.05,4.83 | NKA.5 25.2,5.33 22.91,3.05 22.91,2.03 NKA1.6
D10  (via drill 0.33)
  Top 0.254: v18.85,14.48 18.08,14.48 17.58,13.97 IC3.30 | v26.97,7.87 v25.45,7.87
  Bottom 0.254: v18.85,14.48 20.12,13.21 20.12,9.65 21.89,7.87 v25.45,7.87 | v26.97,7.87 27.74,7.11 27.74,5.33 NKA.4 27.74,5.08 27.74,4.57 25.45,2.29 NKA1.5
D11  (via drill 0.33)
  Top 0.254: v30.28,27.94 29.01,27.94 28.75,28.19 22.91,28.19 21.39,26.67 19.86,26.67 19.35,26.16 IC3.12
  Bottom 0.254: v30.28,27.94 30.53,27.69 30.53,5.59 NKA.3 30.28,5.33 30.28,4.32 27.99,2.03 NKA1.4
D12  (via drill 0.33)
  Top 0.254: v22.4,17.02 22.15,17.27 16.31,17.27 15.29,16.26 IC3.26 | v25.7,33.02 26.72,32 v33.32,32 | v32.82,6.86 33.07,6.6 34.34,6.6 NKA.1
  Bottom 0.254: v22.4,17.02 22.66,17.27 22.66,32.51 23.16,33.02 v25.7,33.02 | v33.32,32 34.09,31.24 34.09,17.78 33.07,16.76 33.07,7.11 v32.82,6.86 | NKA1.2 33.07,2.03 34.09,3.05 34.09,4.06 35.36,5.33 NKA.1
D13  (via drill 0.33)
  Top 0.254: v16.31,10.92 16.81,10.92 17.58,11.68 17.83,11.68 17.83,12.19 18.34,12.7 IC3.32 | v14.53,7.62 14.27,7.87 v8.43,7.87 | v5.38,14.22 v6.65,12.95 | v7.67,52.32 v6.15,50.8 | v8.94,65.53 10.97,67.56 18.34,67.56 20.37,69.6 23.93,69.6 25.2,68.33 B1.1
  Bottom 0.254: v16.31,10.92 14.53,9.14 v14.53,7.62 | v8.43,7.87 6.65,9.65 v6.65,12.95 | v5.38,14.22 6.15,14.99 v6.15,50.8 | v7.67,52.32 8.94,53.59 v8.94,65.53
D+  (via drill 0.33)
  Top 0.254: v41.96,18.8 36.37,18.8 34.59,20.57 RD+1.1 | v41.71,28.19 45.01,28.19 X2.D+
  Bottom 0.254: v41.96,18.8 41.71,19.05 v41.71,28.19
D-  (via drill 0.33)
  Top 0.254: RD-1.1 38.15,20.57 39.42,19.3 41.2,19.3 42.21,20.32 RU1.1 42.47,20.57 v42.47,22.1 | v42.47,27.43 45.01,27.43 X2.D-
  Bottom 0.254: v42.47,22.1 v42.47,27.43
GND  (via drill 0.33)
  Top 0.254: EEPRM.4 7.42,48.01 7.42,46.99 EEPRM.3 7.42,46.74 7.42,45.72 EEPRM.2 | 3.86,45.72 7.16,45.72 EEPRM.2 | 3.86,45.72 2.34,45.72 EEPRM.7 | EEPRM.1 7.42,44.45 7.42,45.47 EEPRM.2 | 9.96,18.8 12.24,18.8 13.26,17.78 IC3.23 | 9.96,18.8 9.45,18.8 8.69,19.56 C7.2 8.43,19.81 4.11,24.13 4.11,29.46 3.1,29.46 JP4.1 | v2.34,35.56 3.35,35.56 | 3.35,35.56 6.65,35.56 7.42,36.32 USB.2 | v3.86,44.96 3.86,45.72 | 3.35,35.56 v3.35,38.86 | v23.93,18.54 25.7,18.54 26.72,17.53 IC3.43 | v23.93,21.59 24.94,22.61 IC3.5 | 16.31,10.16 14.78,10.16 RST.A' | 16.31,10.16 17.07,10.16 19.1,12.19 IC3.33 19.35,12.45 20.37,13.46 21.64,13.46 22.15,12.95 IC3.35 22.4,12.7 22.91,12.19 23.16,12.19 v23.42,11.94 28.5,11.94 28.75,11.68 BAT1.P$1 29.01,11.68 30.53,10.16 v34.59,10.16 | Q4.2 13,31.24 13,27.69 C6.2 13,27.43 15.29,27.43 v15.8,26.92 v17.32,28.45 | v15.8,25.4 16.31,25.4 17.32,24.38 IC3.15 | v18.08,33.02 18.34,33.02 19.1,33.78 WS1.S | RST.A 14.78,3.05 15.8,2.03 17.58,2.03 NKA1.8 | 9.7,15.49 8.43,16.76 IC4.1 | 9.7,15.49 10.97,15.49 C2.2 | C9.2 5.38,1.52 5.38,3.56 8.18,3.56 RTHM.1 | v9.7,14.73 9.7,15.49 | v16.31,7.37 16.31,10.16 | v9.96,19.05 9.96,18.8 | WS2.S 26.97,30.23 27.99,31.24 34.09,31.24 WS3.S 34.34,30.99 34.85,30.48 v35.61,30.48 | v35.61,23.62 31.29,23.62 C3.2 | v43.23,24.64 42.72,24.64 41.71,23.62 C4.2 | LED1.K 40.44,35.05 40.94,35.05 40.94,37.34 WS4.S 41.2,37.59 41.71,38.1 43.48,38.1 | 43.48,38.1 47.04,38.1 47.04,31.24 46.02,30.23 45.52,30.23 45.26,29.97 X2.GND | IC2.2 49.58,20.57 v48.31,20.57 | RC.1 47.04,2.54 43.99,2.54 ISP.6 43.74,2.54 42.47,3.81 34.34,3.81 NKA.2 | v18.59,52.83 18.34,52.83 16.05,50.55 WS9.S
  Top 0.254: v19.61,56.64 21.64,56.64 WS8.S | v6.4,64.77 16.31,64.77 19.61,68.07 20.62,68.07 B1.2 | IC1.9 51.87,69.85 52.37,69.34 53.14,69.34 53.39,69.09 53.39,65.02 51.87,65.02 IC1.5 51.87,64.77 51.87,63.75 IC1.4 51.87,63.5 51.87,62.48 IC1.3 51.61,62.23 51.1,61.72 v49.83,61.72 47.29,64.26 v44.75,64.26 | CEXP1.2 52.12,56.39 52.12,51.82 B2.2 | v38.15,61.47 37.64,60.96 35.86,60.96 33.58,58.67 33.32,58.67 LED4.K 33.07,58.42 30.53,58.42 WS7.S 30.28,58.42 v28.5,58.42 | WS10.S 14.78,41.66 17.83,44.7 18.34,44.7 18.59,44.96 C1.2 18.85,45.21 19.61,45.97 25.96,45.97 26.21,45.72 34.59,45.72 v35.1,46.23 36.88,48.01 38.91,48.01 40.18,49.28 | LED2.K 43.23,43.94 42.72,43.94 42.72,46.23 WS5.S 42.47,46.48 42.47,48.51 40.94,48.51 40.18,49.28 | 39.93,53.09 38.66,54.36 WS6.S | 39.93,53.09 40.69,53.09 LED3.K | 40.18,49.28 39.93,49.53 39.93,53.09 | v43.48,37.85 43.48,38.1
  Bottom 0.254: v2.34,35.56 1.83,35.05 1.83,30.99 JP4.1 | v3.86,44.96 3.35,44.45 v3.35,38.86 | v23.93,21.59 v23.93,18.54 23.42,18.03 v23.42,11.94 | v15.8,25.4 v15.8,26.92 10.97,31.75 10.97,32.51 10.46,33.02 9.19,33.02 9.19,19.05 | v18.08,33.02 17.32,32.26 v17.32,28.45 | 17.83,4.06 17.83,2.03 NKA1.8 | 17.83,4.06 17.83,5.08 NKA.8 17.58,5.33 17.58,6.1 v16.31,7.37 | 9.19,14.22 v9.7,14.73 | 9.19,14.22 9.19,4.57 8.69,4.06 | 8.69,4.06 8.18,3.56 RTHM.1 | 8.69,4.06 17.83,4.06 | 9.19,14.22 9.19,19.05 | 9.19,19.05 v9.96,19.05 | MICROSD.6 36.37,18.29 37.13,18.29 37.64,18.8 37.64,22.1 37.13,22.61 MICROSD.GND1 36.88,22.86 36.37,22.86 v35.61,23.62 v35.61,30.48 35.86,30.73 35.86,31.75 36.12,32 39.67,32 39.67,31.5 43.23,27.94 | 43.23,27.94 43.23,30.48 40.44,33.27 40.44,34.8 LED1.K | 43.23,27.94 v43.23,24.64 43.99,23.88 43.99,17.27 44.25,17.02 45.77,17.02 | 34.59,7.87 36.63,7.87 MICROSD.GND3 | 34.59,7.87 34.59,6.86 33.07,5.33 NKA.2 32.82,5.08 32.82,4.57 30.53,2.29 NKA1.3 | 47.04,21.84 46.53,22.35 46.53,22.61 MICROSD.P$2 | 47.04,21.84 v48.31,20.57 | 45.77,6.6 45.01,5.84 45.01,3.56 43.99,2.54 ISP.6 | 45.77,6.6 46.28,7.11 MICROSD.P$1 45.77,6.6 | 47.04,21.84 45.77,20.57 45.77,17.02 | 45.77,6.6 45.77,17.02 | v18.59,52.83 18.34,53.09 18.34,56.64 | 18.34,56.64 18.34,60.96 19.86,62.48 21.13,62.48 | 21.13,62.48 21.39,62.48 21.39,67.56 20.88,68.07 B1.2 | 18.34,56.64 v19.61,56.64 | 24.94,51.82 23.93,52.83 23.93,54.36 21.13,57.15 21.13,62.48 | 24.94,51.82 25.96,50.8 JP3.2 | v6.4,64.77 6.65,64.52 6.65,61.21 5.38,59.94 JP2.4 | B3.2 52.37,41.66 53.39,42.67 53.39,50.55 52.12,51.82 B2.2 51.87,51.82 51.87,59.69 v49.83,61.72
  Bottom 0.254: JP6.2 31.04,48.01 31.04,43.94 31.29,43.69 35.1,43.69 v35.1,46.23 35.1,56.64 33.32,58.42 LED4.K | v38.15,61.47 38.15,65.53 RAD.1 | v44.75,64.26 41.96,61.47 41.96,55.37 40.94,54.36 40.94,53.09 LED3.K | 24.94,51.82 28.24,55.12 28.24,56.13 28.5,56.39 v28.5,58.42 | v43.48,37.85 43.48,43.69 LED2.K | 34.59,7.87 v34.59,10.16
MISO  (via drill 0.33)
  Top 0.254: v28.75,26.92 27.99,27.69 23.42,27.69 21.89,26.16 IC3.11 | v29.26,18.8 29.77,18.29 v34.85,18.29 39.17,18.29 v39.42,18.03 | v19.86,63.25 27.99,63.25 30.28,65.53 RAD.7 | v19.61,49.28 19.86,49.02 20.12,49.02 v21.89,47.24 | v21.13,30.73 22.66,29.21 28.24,29.21 v28.5,29.46
  Bottom 0.254: v29.26,18.8 29.26,26.42 v28.75,26.92 28.75,29.21 v28.5,29.46 | v34.85,18.29 35.1,18.54 35.1,18.8 35.36,19.05 36.12,19.05 MICROSD.7 | v39.42,18.03 39.17,17.78 39.17,5.33 38.91,5.08 ISP.1 | v19.86,63.25 17.83,61.21 17.83,51.05 v19.61,49.28 | v21.89,47.24 21.89,39.88 21.13,39.12 v21.13,30.73
MOSI  (via drill 0.33)
  Top 0.254: v25.2,25.65 24.69,26.16 22.91,26.16 22.4,25.65 IC3.10 | v25.45,13.97 v34.59,13.97 34.85,13.97 v39.93,8.89 45.26,14.22 49.58,14.22 v50.34,14.99 | v47.8,37.85 47.8,32.77 v48.06,32.77
  Bottom 0.254: v25.2,25.65 25.2,21.59 25.45,21.34 v25.45,13.97 | v34.59,13.97 35.36,14.73 36.12,14.73 MICROSD.3 | v39.93,8.89 39.93,3.81 41.2,2.54 ISP.4 | v47.8,37.85 47.8,44.7 47.29,45.21 47.29,53.09 48.31,54.1 48.31,70.1 34.85,70.1 33.07,68.33 RAD.6 | v48.06,32.77 50.34,30.48 v50.34,14.99
N$1
  Top 0.254: C2.1 10.97,13.72 8.69,13.72 7.67,14.73 IC4.3 7.42,14.99 5.13,14.99 2.08,18.03 SWITCH.3
N$2  (via drill 0.33)
  Top 0.254: X3.P$1 8.94,28.45 7.42,28.45 7.42,22.86 8.43,21.84 C7.1 8.69,21.59 10.97,19.3 17.32,19.3 v18.08,20.07 | v18.08,22.86 17.83,22.86 17.07,23.62 IC3.16
  Bottom 0.254: v18.08,20.07 v18.08,22.86
N$3
  Top 0.254: X3.P$2 9.19,24.64 11.99,24.64 12.75,25.4 C6.1 13,25.4 14.02,25.4 16.05,23.37 IC3.17
N$4
  Top 0.254: WS10.I 11.73,40.64 11.73,42.67 12.5,43.43 12.5,46.48 14.53,46.48 WS9.O
N$5
  Top 0.254: PWR.C 52.37,17.53 50.6,19.3 IC2.1
N$6  (via drill 0.33)
  Top 0.254: v45.01,15.75 50.34,15.75 50.34,16.51 IC2.5 | v44.5,7.11 47.04,4.57 RC.2
  Bottom 0.254: v45.01,15.75 44.5,15.24 v44.5,7.11
N$7  (via drill 0.33)
  Top 0.254: v7.67,34.29 11.48,34.29 11.99,33.78 Q4.3 | v9.7,57.91 13.77,61.98 15.8,61.98 U$1.-
  Bottom 0.254: v7.67,34.29 7.92,34.54 7.92,51.31 9.7,53.09 v9.7,57.91
N$8  (via drill 0.33)
  Top 0.254: v36.63,46.48 36.63,45.21 RN2.4 | v36.63,62.99 37.39,63.75 40.69,63.75 41.71,64.77 42.47,64.77 IC1.14
  Bottom 0.254: v36.63,62.99 v36.63,46.48
N$10
  Top 0.254: PWR.A 52.37,14.99 53.14,14.22 53.14,7.62 51.1,7.62 50.09,6.6 RE1.1
N$11  (via drill 0.33)
  Top 0.254: v37.39,47.24 37.39,45.21 RN2.3 | v38.66,52.32 v37.39,51.05 | v38.4,57.4 39.93,58.93 v45.52,58.93 | v45.52,62.99 45.01,63.5 42.72,63.5 IC1.15
  Bottom 0.254: v37.39,51.05 v37.39,47.24 | v38.66,52.32 38.4,52.58 v38.4,57.4 | v45.52,62.99 v45.52,58.93
N$12
  Top 0.254: NKA.7 22.15,3.56 24.69,3.56 24.94,3.81 27.23,3.81 27.48,3.56 29.77,3.56 30.02,3.81 32.31,3.81 32.56,3.56 33.83,3.56 35.1,2.29 35.36,2.29 NKA1.1
N$13  (via drill 0.33)
  Top 0.254: v40.44,47.5 38.4,47.5 38.4,45.21 RN2.2 | v42.98,52.07 45.77,54.86 v46.28,54.86 | v46.28,61.72 45.77,62.23 42.72,62.23 IC1.16
  Bottom 0.254: v40.44,47.5 42.98,50.04 v42.98,52.07 | v46.28,61.72 v46.28,54.86
N$14  (via drill 0.33)
  Top 0.254: v32.56,57.15 34.85,57.15 35.1,56.9 WS6.O | v32.05,60.45 31.04,61.47 30.53,61.47 WS7.I
  Bottom 0.254: v32.56,57.15 31.8,57.91 31.8,60.2 v32.05,60.45
N$15  (via drill 0.33)
  Top 0.254: v40.44,46.23 39.42,45.21 RN2.1 | v40.69,60.45 41.2,60.96 42.47,60.96 IC1.17
  Bottom 0.254: v40.44,46.23 39.67,46.99 39.67,52.07 39.42,52.32 39.42,55.63 40.69,56.9 v40.69,60.45
N$17  (via drill 0.33)
  Top 0.254: v41.2,41.91 40.94,41.91 39.42,43.43 RN2.8
  Bottom 0.254: v41.2,41.91 41.96,41.15 41.96,33.78 42.21,33.53 LED1.A
N$18
  Top 0.254: RN2.7 38.4,43.43 38.4,42.42 39.42,42.42 40.94,40.89 40.94,39.62 42.72,39.62 45.77,42.67 45.77,43.69 LED2.A
N$19
  Top 0.254: WS4.O 42.47,41.4 43.48,42.42 43.74,42.42 44.75,43.43 44.75,45.21 46.79,45.21 47.04,45.47 47.04,47.5 45.77,47.5 WS5.I
N$20  (via drill 0.33)
  Top 0.254: v45.52,49.78 41.71,49.78 41.45,50.04 WS5.O | v45.52,55.63 44.25,56.9 40.69,56.9 WS6.I
  Bottom 0.254: v45.52,55.63 v45.52,49.78
N$21
  Top 0.254: RD+1.2 32.31,20.83 31.29,21.84 28.24,21.84 27.23,22.86 26.47,22.86 25.7,22.1 IC3.4
N$22  (via drill 0.33)
  Top 0.254: v33.32,22.1 39.93,22.1 39.93,20.57 RD-1.2 | v32.82,19.05 32.56,19.3 30.02,19.3 27.23,22.1 26.72,22.1 26.21,21.59 IC3.3
  Bottom 0.254: v33.32,22.1 32.82,21.59 v32.82,19.05
N$23  (via drill 0.33)
  Top 0.254: v23.93,29.97 22.66,31.24 WS1.O | v24.94,26.92 26.72,26.92 WS2.I
  Bottom 0.254: v23.93,29.97 24.94,28.96 v24.94,26.92
N$24
  Top 0.254: WS3.I 36.12,28.7 35.1,29.72 31.04,29.72 30.78,29.97 WS2.O
N$25  (via drill 0.33)
  Top 0.254: v43.23,32 41.96,32 41.71,32.26 38.91,32.26 37.64,33.53 WS3.O | v43.48,34.8 43.48,36.32 44.25,36.32 WS4.I
  Bottom 0.254: v43.23,32 43.74,32.51 43.74,34.54 v43.48,34.8
N$26  (via drill 0.33)
  Top 0.254: v38.91,41.66 37.64,41.66 37.64,43.43 RN2.6 | v45.52,30.99 v41.45,30.99
  Bottom 0.254: v38.91,41.66 38.91,33.53 v41.45,30.99 | v45.52,30.99 46.79,32.26 46.79,42.93 47.29,43.43 47.29,44.45 46.53,45.21 45.26,45.21 45.26,48.77 44.75,49.28 44.75,60.2 45.01,60.45 45.01,61.47 44.75,61.72 42.98,61.72 42.98,54.61 LED3.A
N$27  (via drill 0.33)
  Top 0.254: v11.73,52.07 11.99,52.07 12.5,51.56 WS9.I | v13,55.12 13.77,55.88 15.04,55.88 16.05,54.86 16.05,54.36 18.59,54.36 WS8.O
  Bottom 0.254: v11.73,52.07 13,53.34 v13,55.12
N$28  (via drill 0.33)
  Top 0.254: v22.4,58.93 20.37,58.93 20.12,59.18 WS8.I | v23.67,56.64 24.18,57.15 25.2,57.15 26.21,58.17 WS7.O
  Bottom 0.254: v22.4,58.93 22.4,57.91 v23.67,56.64
N$29  (via drill 0.33)
  Top 0.254: v21.13,45.21 34.85,45.21 36.37,43.69 RN2.5 | v20.62,54.61 21.13,55.12 21.64,55.12 22.15,55.63 v25.45,55.63 | v28.24,59.44 32.31,59.44 33.58,60.71 33.83,60.71 LED4.A
  Bottom 0.254: v21.13,45.21 21.13,54.1 v20.62,54.61 | v25.45,55.63 27.74,55.63 27.74,56.39 27.99,56.64 27.99,57.66 27.74,57.91 27.74,58.93 v28.24,59.44
N$30  (via drill 0.33)
  Top 0.254: v14.53,36.07 16.05,36.07 16.81,35.31 LED8.K | v16.81,55.12 19.86,58.17 23.42,58.17 23.67,58.42 LED5.K
  Bottom 0.254: 14.02,44.2 16.56,44.2 16.56,52.83 LED6.K 16.56,53.09 16.56,54.86 v16.81,55.12 | 14.02,44.2 13.77,44.2 LED7.K 14.02,44.2 | v14.53,36.07 14.02,36.58 14.02,44.2
N$31  (via drill 0.33)
  Top 0.254: v24.18,10.67 20.62,10.67 19.86,9.91 T1.1
  Bottom 0.254: v24.18,10.67 26.21,8.64 26.21,7.37 25.7,6.86 22.91,6.86 22.91,5.33 NKA.6 22.66,5.08 22.66,4.57 20.37,2.29 NKA1.7
N$32  (via drill 0.33)
  Top 0.254: v25.45,53.59 27.23,53.59 RN1.8
  Bottom 0.254: v25.45,53.59 21.64,57.4 21.64,59.44 22.91,60.71 LED5.A
N$33  (via drill 0.33)
  Top 0.254: v26.21,56.39 26.97,56.39 27.23,56.13 RN1.5
  Bottom 0.254: v26.21,56.39 25.2,57.4 25.2,64.52 22.15,67.56 22.15,68.58 21.13,69.6 14.53,69.6 14.53,54.61 LED6.A
N$34  (via drill 0.33)
  Top 0.254: v20.37,53.59 20.88,53.59 22.15,54.86 25.96,54.86 26.21,55.12 27.23,55.12 RN1.6 | v20.37,47.5 16.05,47.5 15.29,48.26 v13.51,48.26
  Bottom 0.254: v20.37,47.5 v20.37,53.59 | v13.51,48.26 11.23,45.97 11.23,44.2 LED7.A
N$35  (via drill 0.33)
  Top 0.254: v17.83,49.78 22.4,54.36 27.23,54.36 RN1.7
  Bottom 0.254: v17.83,49.78 17.07,49.02 17.07,37.34 15.04,35.31 15.04,33.78 LED8.A
N$37  (via drill 0.33)
  Top 0.254: v30.02,53.59 29.01,53.59 RN1.1 | v31.29,64.01 31.55,64.26 39.93,64.26 41.71,66.04 42.47,66.04 IC1.13
  Bottom 0.254: v30.02,53.59 31.29,54.86 v31.29,64.01
N$38  (via drill 0.33)
  Top 0.254: v40.44,55.37 39.93,55.88 37.9,55.88 36.37,54.36 29.01,54.36 RN1.2 | v40.69,66.29 41.71,67.31 42.47,67.31 IC1.12
  Bottom 0.254: v40.44,55.37 41.45,56.39 41.45,65.53 v40.69,66.29
N$39  (via drill 0.33)
  Top 0.254: v39.17,56.64 37.9,56.64 36.37,55.12 29.01,55.12 RN1.3 | v39.67,67.06 41.2,68.58 42.47,68.58 IC1.11
  Bottom 0.254: v39.17,56.64 39.67,57.15 v39.67,67.06
N$40  (via drill 0.33)
  Top 0.254: v30.02,57.15 29.01,56.13 RN1.4 | v28.24,68.07 30.02,69.85 42.47,69.85 IC1.10
  Bottom 0.254: v30.02,57.15 30.02,63.25 28.24,65.02 v28.24,68.07
RESET  (via drill 0.33)
  Top 0.254: v15.04,26.16 17.58,26.16 | 17.58,26.16 17.83,26.16 18.34,25.65 IC3.13 | v13,11.43 11.73,10.16 10.97,10.16 RST.B' | v40.69,10.92 35.36,16.26 v29.77,16.26 | v29.51,28.7 22.66,28.7 21.13,27.18 18.59,27.18 17.58,26.16 | v10.97,5.84 10.97,3.3 RST.B
  Bottom 0.254: v15.04,26.16 13,24.13 v13,11.43 13,7.87 v10.97,5.84 | v40.69,10.92 40.69,8.13 43.74,5.08 ISP.5 | v29.77,16.26 30.02,16.51 30.02,26.92 29.51,27.43 v29.51,28.7
RX  (via drill 0.33)
  Top 0.254: v18.08,48.77 15.29,48.77 14.78,49.28 v14.27,49.28 3.61,49.28 1.83,51.05 1.32,51.05 1.32,53.34 2.59,54.61 JP2.7 | v18.85,46.74 19.1,46.48 v26.72,46.48 | v19.1,36.83 24.69,36.83 25.7,37.85 JP5.4 | v17.83,39.62 17.58,39.88 14.27,39.88 v12.5,41.66
  Bottom 0.254: v18.08,48.77 18.85,48.01 v18.85,46.74 | v26.72,46.48 31.04,42.16 JP1.4 | v19.1,36.83 17.83,38.1 v17.83,39.62 | v12.5,41.66 12.5,45.97 14.27,47.75 v14.27,49.28
SCK  (via drill 0.33)
  Top 0.254: v25.96,24.89 24.69,24.89 23.93,25.65 23.42,25.65 22.91,25.15 IC3.9 | v29.77,7.37 30.02,7.62 33.83,7.62 | 33.83,7.62 38.66,7.62 41.2,5.08 ISP.3 | 33.83,7.62 v33.83,7.37 | v36.88,35.31 35.36,33.78 v28.75,33.78
  Bottom 0.254: v29.77,7.37 29.77,8.64 26.47,11.94 26.47,24.38 v25.96,24.89 25.96,30.99 v28.75,33.78 | v33.83,7.37 33.83,14.48 34.09,14.73 34.09,17.02 36.12,17.02 MICROSD.5 | v36.88,35.31 36.88,38.61 35.86,39.62 35.86,62.74 33.07,65.53 RAD.5
SCL  (via drill 0.33)
  Top 0.254: RSCL.1 2.59,68.58 2.59,65.79 2.08,65.79 0.56,64.26 0.56,59.94 2.59,59.94 JP2.3 | 1.07,47.24 1.83,47.24 2.08,46.99 EEPRM.6 | 1.07,47.24 0.56,47.75 0.56,49.53 v0.81,49.53 | v21.64,22.1 16.31,22.1 15.8,22.61 IC3.18 | v51.36,50.29 53.39,50.29 53.39,57.15 52.88,57.66 51.87,57.66 51.87,59.69 IC1.1 | v48.56,44.45 47.8,43.69 47.8,39.37 v48.56,39.37 | v46.53,17.53 45.52,16.51 44.25,16.51 43.74,16 v42.21,16 | v36.63,31.24 34.85,33.02 v31.29,33.02 | v21.13,41.66 21.64,42.16 24.43,42.16 25.96,40.64 JP1.2 | 1.07,47.24 1.07,46.48 0.56,45.97 0.56,42.16 v10.46,42.16 | v13.26,38.61 14.27,37.59 v14.78,37.59 | v16.31,40.64 16.56,40.39 20.12,40.39 v20.37,40.13
  Bottom 0.254: v0.81,49.53 0.81,57.4 2.59,59.18 2.59,59.69 JP2.3 | v21.64,22.1 22.15,22.61 22.15,28.45 | 22.15,28.45 22.15,32.77 23.93,34.54 29.51,34.54 29.51,34.04 29.77,33.78 31.04,33.78 | 31.04,33.78 31.04,37.85 JP5.2 | v51.36,50.29 47.8,46.74 47.8,45.47 48.56,44.7 v48.56,44.45 | v48.56,39.37 48.56,37.34 47.29,36.07 47.29,32.26 48.82,30.73 48.82,21.34 49.07,21.08 49.07,20.07 v46.53,17.53 | v42.21,16 40.18,18.03 40.18,27.69 v36.63,31.24 | v31.29,33.02 31.04,33.27 31.04,33.78 | v21.13,41.66 20.37,40.89 v20.37,40.13 20.37,30.23 22.15,28.45 | v10.46,42.16 13.26,39.37 v13.26,38.61 | v14.78,37.59 16.31,39.12 v16.31,40.64
SDA  (via drill 0.33)
  Top 0.254: v1.32,63.75 3.86,66.29 RSDA.1 | v1.07,58.93 2.59,57.4 JP2.5 2.59,57.15 0.81,57.15 0.81,50.8 1.57,50.04 2.08,50.04 2.08,48.26 EEPRM.5 | v24.69,20.83 16.31,20.83 15.29,21.84 IC3.19 15.04,22.1 14.27,22.86 v10.46,22.86 | v23.67,32.26 26.21,34.8 v30.28,34.8 34.59,34.8 v34.85,34.54 | v44.25,60.96 51.61,60.96 IC1.2 | v44.75,17.78 43.74,16.76 32.56,16.76 v32.31,17.02 | v34.85,25.91 v33.32,24.38 | JP1.3 28.5,38.35 JP5.3 | v3.1,32.51 3.35,32.26 v9.96,32.26
  Bottom 0.254: v1.32,63.75 1.07,63.5 v1.07,58.93 | v24.69,20.83 24.69,24.89 23.16,26.42 23.16,31.75 v23.67,32.26 | v30.28,34.8 28.5,36.58 28.5,38.1 JP5.3 | v44.25,60.96 44.25,47.24 44.75,46.74 44.75,40.64 45.01,40.39 45.01,31.75 44.75,31.5 v44.75,17.78 | v32.31,17.02 32.05,17.27 32.05,23.11 v33.32,24.38 | v34.85,34.54 v34.85,25.91 | v3.1,32.51 3.1,36.58 1.57,38.1 1.57,50.04 1.32,50.29 1.32,55.88 2.59,57.15 JP2.5 | v9.96,32.26 10.46,31.75 v10.46,22.86
TX  (via drill 0.33)
  Top 0.254: 18.08,38.61 18.34,38.86 22.66,38.86 23.16,38.35 JP5.5 | 18.08,38.61 18.08,35.56 v35.86,35.56 | v2.34,39.37 2.59,39.62 10.21,39.62 11.23,38.61 11.99,38.61 12.75,39.37 16.81,39.37 17.58,38.61 18.08,38.61
  Bottom 0.254: v35.86,35.56 36.37,36.07 36.37,38.35 34.09,40.64 33.58,40.64 JP1.5 | v2.34,39.37 2.34,51.82 2.59,52.07 JP2.9
VBAT  (via drill 0.33)
  Top 0.254: IC2.3 48.82,19.3 48.82,17.78 51.1,17.78 51.36,17.53 51.36,11.68 BAT1.P$2 50.34,11.68 46.79,8.13 28.5,8.13 27.23,6.86 24.94,6.86 24.69,6.6 v21.39,6.6 | v4.37,38.61 7.42,38.61 USB.1 | v17.58,7.37 16.81,6.6 4.88,6.6 3.86,5.59 v2.08,5.59
  Bottom 0.254: 4.11,23.11 4.62,23.62 4.62,30.73 JP4.2 4.62,30.99 3.86,31.75 3.86,38.1 v4.37,38.61 | 4.11,23.11 SWITCH.2 | v21.39,6.6 20.62,7.37 v17.58,7.37 | v2.08,5.59 1.57,6.1 1.57,11.43 4.11,13.97 4.11,23.11
VBUS  (via drill 0.33)
  Top 0.254: v49.58,17.02 49.07,17.02 48.82,16.76 IC2.4 | v49.58,25.65 48.06,27.18 47.04,27.18 46.53,26.67 45.26,26.67 X2.VBUS 45.01,26.67 44.5,26.16 v39.42,26.16 | 48.31,1.02 40.18,1.02 38.91,2.29 ISP.2 | 48.31,1.02 52.63,1.02 52.63,4.06 52.12,4.57 52.12,6.35 RE1.2 | v48.06,6.1 48.06,5.59 48.31,5.33 48.31,1.02 | 19.61,43.43 v20.12,43.43 30.78,43.43 v31.8,44.45 | 19.61,43.43 18.85,43.43 C1.1 | v20.62,25.15 22.66,23.11 23.42,23.11 23.93,23.62 IC3.7 24.18,23.88 24.69,24.38 24.94,24.38 25.2,24.13 26.72,24.13 28.5,22.35 32.05,22.35 32.56,22.86 36.12,22.86 v37.13,23.88 | 19.61,43.43 v19.61,41.91 | v19.61,48.26 18.85,48.26 18.85,49.78 19.1,50.04 22.66,50.04 23.42,50.8 JP3.1 | v15.29,64.01 6.91,64.01 5.38,62.48 JP2.2 | v17.07,59.94 17.58,60.45 v19.1,60.45
  Bottom 0.254: v49.58,25.65 v49.58,17.02 48.06,15.49 v48.06,6.1 | v31.8,44.45 33.32,45.97 33.32,48.26 JP6.1 | v20.62,25.15 19.86,25.91 19.86,39.37 19.61,39.62 v19.61,41.91 | v19.61,48.26 19.61,43.94 v20.12,43.43 | v15.29,64.01 17.07,62.23 v17.07,59.94 | v19.1,60.45 20.62,58.93 20.62,55.88 23.42,53.09 JP3.1 | v37.13,23.88 v39.42,26.16
VCC  (via drill 0.33)
  Top 0.254: v44.25,66.29 51.61,66.29 IC1.6 | 38.91,59.69 42.47,59.69 IC1.18 42.72,59.69 v47.04,59.69 50.09,56.64 CEXP1.1 50.09,56.39 45.26,51.56 44.75,51.56 WS5.D | 38.91,59.69 37.39,59.69 WS6.D | JP3.3 28.5,48.51 JP6.3 | RSCL.2 4.88,68.58 4.88,67.82 6.15,66.55 RSDA.2 6.15,66.29 6.91,65.53 v7.42,65.53 | 8.94,57.15 5.38,57.15 JP2.6 | 8.94,57.15 13,57.15 | 13,57.15 16.56,57.15 WS8.D | 13,57.15 16.56,60.71 17.07,60.71 18.59,62.23 25.7,62.23 26.21,61.72 WS7.D 26.47,61.47 27.99,61.47 | 8.94,57.15 8.94,61.98 U$1.+ | 27.99,61.47 v29.26,60.2 | 38.91,59.69 38.91,62.23 32.05,62.23 31.55,62.74 29.26,62.74 27.99,61.47 | 37.39,25.65 36.37,26.67 30.78,26.67 WS2.D 30.53,26.67 29.51,26.67 29.51,23.62 C3.1 | 37.39,25.65 37.64,25.4 | 37.64,25.4 39.42,23.62 C4.1 | 46.79,22.35 44.5,22.35 44.5,20.57 RU1.2 | 46.79,22.35 47.04,22.61 47.04,25.4 v43.99,25.4 39.42,25.4 | 37.64,25.4 39.42,25.4 | v51.1,21.84 50.6,22.35 46.79,22.35 | 39.42,25.4 v39.42,24.89 | 37.39,25.65 38.66,26.92 39.42,26.92 39.42,30.73 WS3.D | v44.25,39.88 45.26,39.88 45.52,40.13 WS4.D | IC3.14 18.08,24.89 20.12,22.86 v20.88,22.86 22.15,22.86 22.4,22.61 23.93,22.61 24.43,23.11 IC3.6 | 20.88,8.64 20.88,9.65 T2.2 | 20.88,8.64 20.88,7.87 T1.2 | 21.13,11.68 20.62,11.18 19.86,11.18 18.85,10.16 18.85,8.64 20.88,8.64 | 21.13,11.68 21.64,12.19 IC3.34 | 27.99,16.76 27.23,16 26.72,16 26.21,16.51 IC3.42 | 27.99,16.76 27.99,17.78 27.48,17.78 IC3.44 27.23,18.03 25.96,19.3 22.4,19.3 21.39,18.29 20.88,18.29 | 7.67,18.03 7.92,18.29 11.23,18.29 12.75,16.76 13.51,16.76 14.02,17.27 IC3.24 14.27,17.53 15.04,18.29 20.88,18.29 | 7.67,18.03 6.65,17.02 IC4.2
  Top 0.254: v20.88,11.68 21.13,11.68 | 20.88,18.29 v20.88,18.54 | 8.94,43.43 8.94,44.96 11.48,47.5 WS9.D | 8.94,43.43 3.1,43.43 2.34,44.2 EEPRM.8 | v6.91,2.79 6.91,1.52 C9.1 | v10.46,35.56 11.73,35.56 12.75,36.58 WS10.D | v14.78,31.5 14.78,30.48 15.8,29.46 19.61,29.46 20.37,28.7 WS1.D | v9.45,42.93 8.94,43.43 | v7.42,18.29 7.67,18.03 | v34.85,15.49 34.59,15.75 30.53,15.75 30.28,15.49 29.26,15.49 27.99,16.76
  Bottom 0.254: RAD.2 38.15,68.33 38.15,69.09 41.45,69.09 v44.25,66.29 47.04,63.5 v47.04,59.69 | v7.42,65.53 7.16,65.28 7.16,59.18 5.38,57.4 JP2.6 5.38,57.15 6.91,55.63 6.91,32 | v29.26,60.2 29.26,56.39 28.75,55.88 28.75,51.31 28.5,51.05 JP3.3 | v51.1,21.84 51.1,7.87 RSD.2 | v39.42,24.89 38.66,24.13 38.66,16 36.37,16 MICROSD.4 36.12,15.75 34.85,15.75 v34.85,15.49 | v44.25,39.88 44.25,25.65 v43.99,25.4 | v20.88,11.68 21.13,11.94 21.13,18.29 v20.88,18.54 v20.88,22.86 | v6.91,2.79 4.62,5.08 4.62,8.89 3.1,10.41 THM1.2 3.1,10.67 6.65,14.22 6.65,18.29 | 6.91,32 6.65,31.75 6.65,18.29 | 6.91,32 9.7,34.8 | 9.7,34.8 v10.46,35.56 | v14.78,31.5 11.73,34.54 11.73,37.08 10.97,37.85 9.7,37.85 | 9.7,34.8 9.7,37.85 | v9.45,42.93 9.7,42.67 9.7,37.85 | 6.65,18.29 v7.42,18.29

### Text on the board
tPlace: L5 | L4 | L6 | L3 | L7 | L2 | L8 | L1
tNames: publiclab.org/wiki/open-lux | PUBLIC | LAB | VBUS | GND | VCC | A0 | A1 | A2 | SCL | SDA | RX | TX | OPEN-LUX | ************** | REV-U | VBAT | GND | USB
bNames: MOSI | (X) | A4 | VCC | Hardware License | SCK | GND | A2 | MISO | GND | A5 | A1 | VCC | CERN Open | Ver. 1.1 | A0 | VBUS | TX | SCL | RX | SDA | VBUS | A1 | A0 | VCC | GND | TX | RX | A2 | SDA | SCL | PUBLICLAB.ORG/WIKI/OPEN-LUX | D10 | GND | LED | LCD | D9 | D11 | D11 | GND | D12 | GND | LCD | D9 | D10 | GND | D12 | LED | MISO | SCK | RST | VBUS | GND | MOSI